# Altium schematic sheet HV_BUCK_V2.SchDoc (part 1 of 3)
size A; SheetNumber: 5; SheetTotal: 8
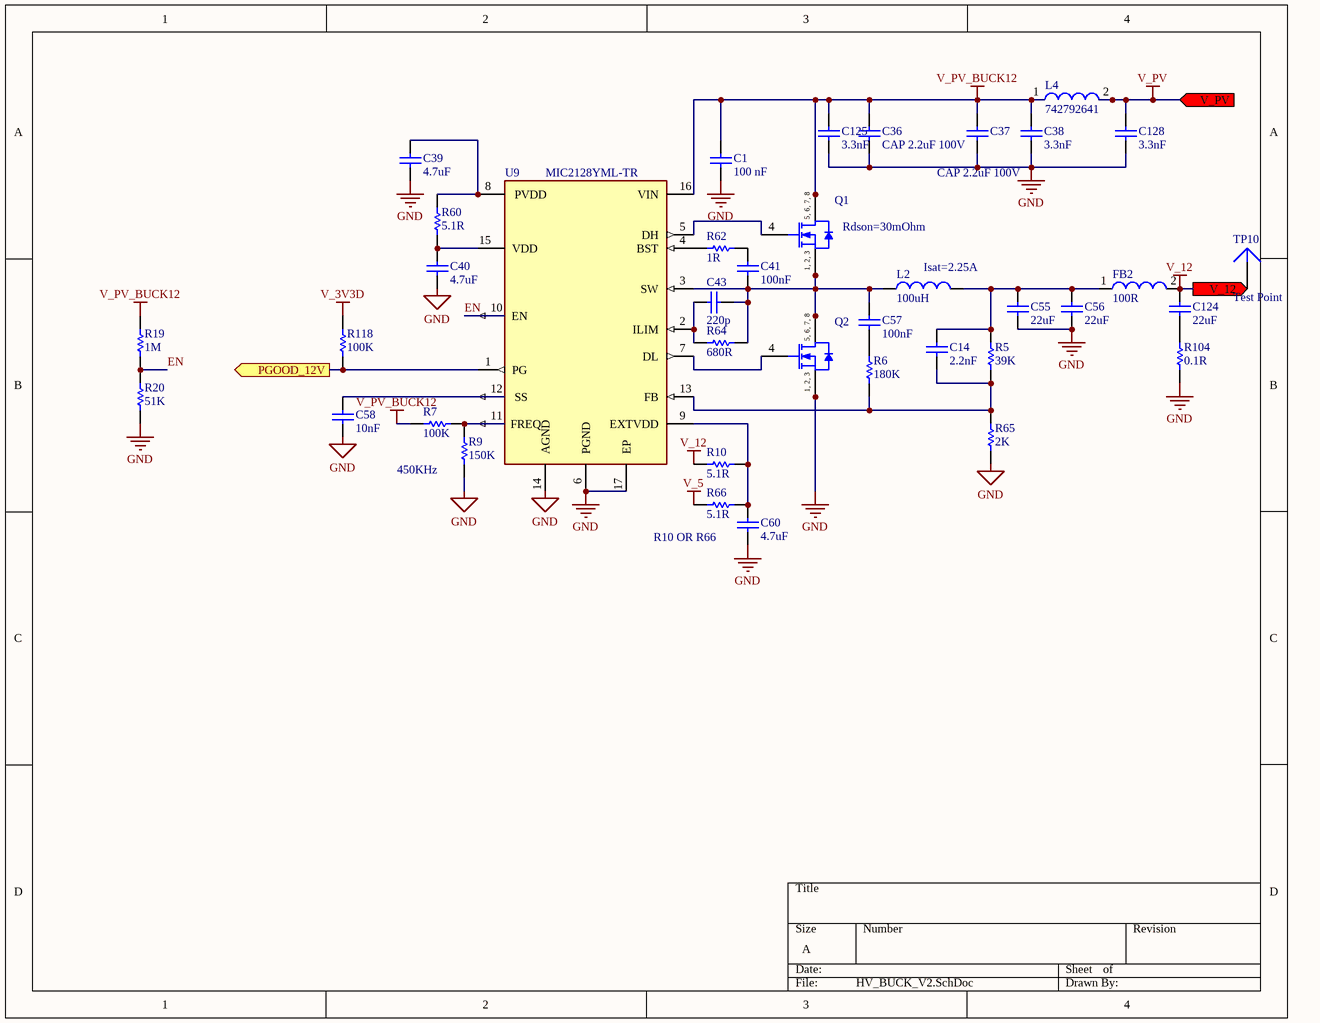
[diagram p0: HV_BUCK_V2.SchDoc]

## Parts
C1  100 nF  [CAPC2013X94X50NL20T25]
C14  2.2nF  [CAPC1005X56X25NL10T15]
C36  CAP 2.2uF 100V  [CAPC1210(3225)280_N]
C37  CAP 2.2uF 100V  [CAPC1210(3225)280_N]
C38  3.3nF  [CAPC1608X90X35LL15T15]
C39  4.7uF  [CAPC2013X135X45LL10T25]
C40  4.7uF  [CAPC2013X135X45LL10T25]
C41  100nF  [CAPC1005X56X25NL10T15]
C43  220p  [CAPC1005X56X25NL10T15]
C55  22uF  [CAPC3225X279X50NL20T25]
C56  22uF  [CAPC3225X279X50NL20T25]
C57  100nF  [CAPC1608X90X35NL10T15]
C58  10nF  [CAPC1005X56X25NL10T15]
C60  4.7uF  [CAPC2013X135X45LL10T25]
C124  22uF  [CAPC3225X279X50NL20T25]
C125  3.3nF  [CAPC1608X90X35LL15T15]
C128  3.3nF  [CAPC1608X90X35LL15T15]
FB2  100R  [SMD-0603]
L2  100uH  [VISH-IHLP4040DZER101M11_V]
L4  742792641  [RESC2012X70N]
Q1  IAUZ20N08S5L300  [INF-PG-TSDSON-8-1_V]  (value not drawn)
Q2  IAUZ20N08S5L300  [INF-PG-TSDSON-8-1_V]  (value not drawn)
R5  39K  [RESC1005X40X25NL05T10]
R6  180K  [RESC1608X55X30NL15T15]
R7  100K  [RESC1608X55X25NL10T15]
R9  150K  [RESC1608X55X25NL10T15]
R10  5.1R  [RESC1608X55X30NL15T15]
R19  1M  [RESC1608X55X25NL10T15]
R20  51K  [RESC1608X55X25NL10T15]
R60  5.1R  [RESC1608X55X30NL15T15]
R62  1R  [RESC1005X40X25NL05T10]
R64  680R  [RESC1005X40X25NL05T10]
R65  2K  [RESC1005X40X25NL05T10]
R66  5.1R  [RESC1608X55X30NL15T15]
R104  0.1R  [RESC1608X55X25ML10T15]
R118  100K  [RESC1608X55X25NL10T15]
TP10  Test Point  [TP1.5mm]
U9  MIC2128YML-TR  [QFN50P300X300X90-17N]

## Ports
PGOOD_12V (out), V_12 (out), V_PV (in)

## Nets
GND: C1.1 C36.1 C37.1 C38.1 C39.1 C40.1 C55.1 C56.1 C58.1 C60.1 C125.1 C128.1 Q2.1(SOURCE) Q2.2(SOURCE) Q2.3(SOURCE) R9.1 R20.1 R65.1 R104.1 U9.6(PGND) U9.14(AGND) U9.17(EP)
V_3V3D: R118.2
V_5: R66.2
V_12: C124.2 FB2.2 R10.2 TP10.1 ; port V_12
V_PV: C128.2 L4.2 ; port V_PV
V_PV_BUCK12: C1.2 C36.2 C37.2 C38.2 C125.2 L4.1 Q1.5(DRAIN) Q1.6(DRAIN) Q1.7(DRAIN) Q1.8(DRAIN) R7.1 R19.2 U9.16(VIN)
EN: R19.1 R20.2 U9.10(EN)
PGOOD_12V: R118.1 U9.1(PG) ; port PGOOD_12V
NetC14_1: C14.1 R5.1 R6.1 R65.2 U9.13(FB)
NetC14_2: C14.2 C55.2 C56.2 FB2.1 L2.2 R5.2
NetC39_2: C39.2 R60.2 U9.8(PVDD)
NetC40_2: C40.2 R60.1 U9.15(VDD)
NetC41_1: C41.1 C43.1 C57.2 L2.1 Q1.1(SOURCE) Q1.2(SOURCE) Q1.3(SOURCE) Q2.5(DRAIN) Q2.6(DRAIN) Q2.7(DRAIN) Q2.8(DRAIN) R64.1 U9.3(SW)
NetC41_2: C41.2 R62.1
NetC43_2: C43.2 R64.2 U9.2(ILIM)
NetC57_1: C57.1 R6.2
NetC58_2: C58.2 U9.12(SS)
NetC60_2: C60.2 R10.1 R66.1 U9.9(EXTVDD)
NetC124_1: C124.1 R104.2
NetQ1_4: Q1.4(GATE) U9.5(DH)
NetQ2_4: Q2.4(GATE) U9.7(DL)
NetR7_2: R7.2 R9.2 U9.11(FREQ)
NetR62_2: R62.2 U9.4(BST)

## Notes on the sheet
- (near Q1) Rdson=30mOhm
- (near L2) Isat=2.25A
- 450KHz
- R10 OR R66
- (in symbol CMP-1091-00311-1) 5, 6, 7, 8; 1, 2, 3